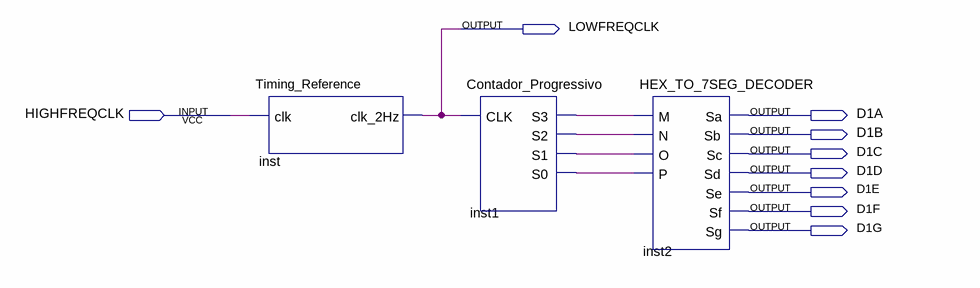
[diagram p0: schematic sheet]
// Quartus schematic tmp.bdf as structural Verilog: 3 symbols, 9 pins
module tmp (
  input  HIGHFREQCLK,
  output LOWFREQCLK,
  output D1A,
  output D1B,
  output D1C,
  output D1D,
  output D1E,
  output D1F,
  output D1G
);

  wire inst1_s0, inst1_s1, inst1_s2, inst1_s3;

  Timing_Reference inst (.clk(HIGHFREQCLK), .clk_2Hz(LOWFREQCLK));
  Contador_Progressivo inst1 (.CLK(LOWFREQCLK), .S3(inst1_s3), .S2(inst1_s2), .S1(inst1_s1), .S0(inst1_s0));
  HEX_TO_7SEG_DECODER inst2 (
    .M(inst1_s3), .N(inst1_s2), .O(inst1_s1), .P(inst1_s0), .Sa(D1A), .Sb(D1B), .Sc(D1C), .Sd(D1D), .Se(D1E),
    .Sf(D1F), .Sg(D1G));
endmodule
